# Altium schematic sheet PowerBRDConn.SchDoc
size A4; SheetNumber: 10; SheetTotal: 10
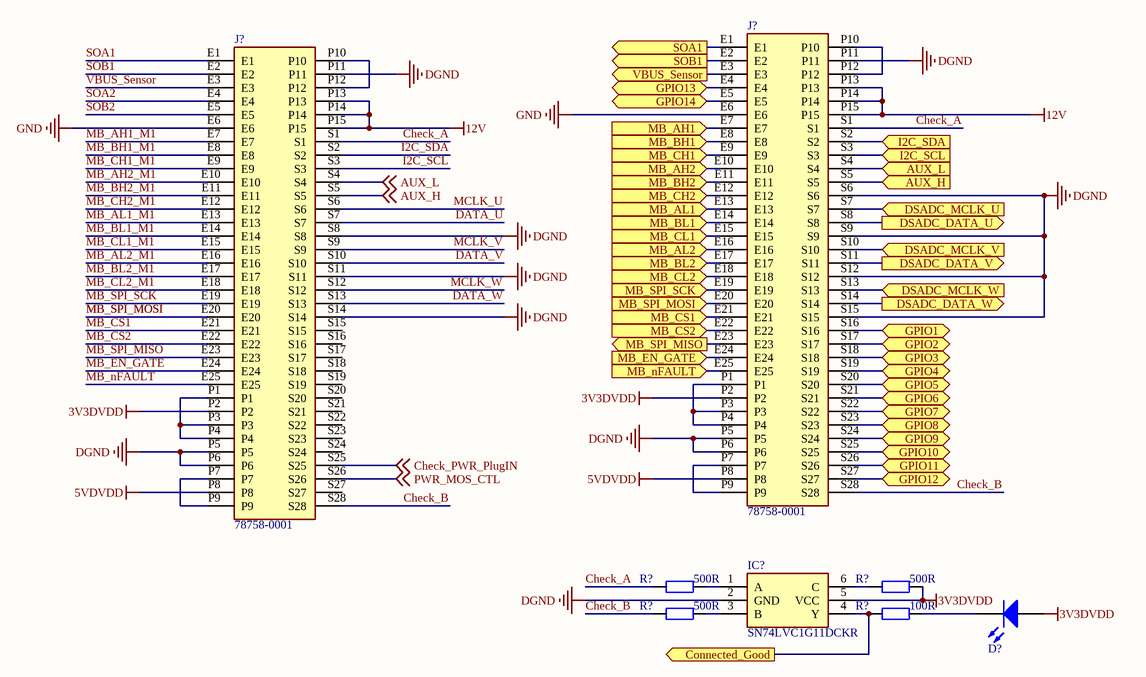
[diagram p0: PowerBRDConn.SchDoc]

## Parts
(Parts that share a designator on the sheet are numbered #1, #2 ... from top to bottom, then left to right.)
D?  LED  [LED_A2]  (value not drawn)
IC?  SN74LVC1G11DCKR  [SOT65P210X110-6N]
J?#1  78758-0001  [78758-0001]
J?#2  78758-0001  [78758-0001]
R?#1  500R  [R 0603_L]
R?#2  500R  [R 0603_L]
R?#3  500R  [R 0603_L]
R?#4  100R  [R 0603_L]

## Ports
AUX_H (in), AUX_L (in), Connected_Good (out), DSADC_DATA_U (out), DSADC_DATA_V (out), DSADC_DATA_W (out), DSADC_MCLK_U (in), DSADC_MCLK_V (in), DSADC_MCLK_W (in), GPIO1 (bidir), GPIO2 (bidir), GPIO3 (bidir), GPIO4 (bidir), GPIO5 (bidir), GPIO6 (bidir), GPIO7 (bidir), GPIO8 (bidir), GPIO9 (bidir), GPIO10 (bidir), GPIO11 (bidir), GPIO12 (bidir), GPIO13 (bidir), GPIO14 (bidir), I2C_SCL (in), I2C_SDA (in), MB_AH1 (in), MB_AH2 (in), MB_AL1 (in), MB_AL2 (in), MB_BH1 (in), MB_BH2 (in), MB_BL1 (in), MB_BL2 (in), MB_CH1 (in), MB_CH2 (in), MB_CL1 (in), MB_CL2 (in), MB_CS1 (in), MB_CS2 (in), MB_EN_GATE (in), MB_nFAULT (in), MB_SPI_MISO (out), MB_SPI_MOSI (in), MB_SPI_SCK (in), SOA1 (out), SOB1 (out), VBUS_Sensor (out)

## Nets
3V3DVDD: D?.1(A) IC?.5(VCC) J?#1.P2 J?#2.P2 R?#2.1
5VDVDD: J?#1.P8 J?#2.P8
12V: J?#1.P13 J?#1.P14 J?#1.P15 J?#2.P13 J?#2.P14 J?#2.P15
DGND: IC?.2(GND) J?#1.P5 J?#1.P6 J?#1.P11 J?#1.S6 J?#1.S9 J?#1.S12 J?#1.S15 J?#2.P5 J?#2.P6 J?#2.P11 J?#2.S8 J?#2.S11 J?#2.S14
GND: J?#1.E6 J?#2.E6
AUX_H: J?#1.S5 ; port AUX_H
AUX_H: J?#2.S5 ; off-sheet AUX_H  [a separate net that carries the same name]
AUX_L: J?#1.S4 ; port AUX_L
AUX_L: J?#2.S4 ; off-sheet AUX_L  [a separate net that carries the same name]
Check_A: J?#1.S1 J?#2.S1 R?#1.2
Check_B: J?#1.S28 J?#2.S28 R?#3.2
Check_PWR_PlugIN: J?#2.S25 ; off-sheet Check_PWR_PlugIN
Connected_Good: IC?.4(Y) R?#4.2 ; port Connected_Good
DATA_U: J?#2.S7
DATA_V: J?#2.S10
DATA_W: J?#2.S13
DSADC_DATA_U: J?#1.S8 ; port DSADC_DATA_U
DSADC_DATA_V: J?#1.S11 ; port DSADC_DATA_V
DSADC_DATA_W: J?#1.S14 ; port DSADC_DATA_W
DSADC_MCLK_U: J?#1.S7 ; port DSADC_MCLK_U
DSADC_MCLK_V: J?#1.S10 ; port DSADC_MCLK_V
DSADC_MCLK_W: J?#1.S13 ; port DSADC_MCLK_W
GPIO1: J?#1.S16 ; port GPIO1
GPIO2: J?#1.S17 ; port GPIO2
GPIO3: J?#1.S18 ; port GPIO3
GPIO4: J?#1.S19 ; port GPIO4
GPIO5: J?#1.S20 ; port GPIO5
GPIO6: J?#1.S21 ; port GPIO6
GPIO7: J?#1.S22 ; port GPIO7
GPIO8: J?#1.S23 ; port GPIO8
GPIO9: J?#1.S24 ; port GPIO9
GPIO10: J?#1.S25 ; port GPIO10
GPIO11: J?#1.S26 ; port GPIO11
GPIO12: J?#1.S27 ; port GPIO12
GPIO13: J?#1.E4 ; port GPIO13
GPIO14: J?#1.E5 ; port GPIO14
I2C_SCL: J?#1.S3 ; port I2C_SCL
I2C_SCL: J?#2.S3  [a separate net that carries the same name]
I2C_SDA: J?#1.S2 ; port I2C_SDA
I2C_SDA: J?#2.S2  [a separate net that carries the same name]
MB_AH1: J?#1.E7 ; port MB_AH1
MB_AH1_M1: J?#2.E7
MB_AH2: J?#1.E10 ; port MB_AH2
MB_AH2_M1: J?#2.E10
MB_AL1: J?#1.E13 ; port MB_AL1
MB_AL1_M1: J?#2.E13
MB_AL2: J?#1.E16 ; port MB_AL2
MB_AL2_M1: J?#2.E16
MB_BH1: J?#1.E8 ; port MB_BH1
MB_BH1_M1: J?#2.E8
MB_BH2: J?#1.E11 ; port MB_BH2
MB_BH2_M1: J?#2.E11
MB_BL1: J?#1.E14 ; port MB_BL1
MB_BL1_M1: J?#2.E14
MB_BL2: J?#1.E17 ; port MB_BL2
MB_BL2_M1: J?#2.E17
MB_CH1: J?#1.E9 ; port MB_CH1
MB_CH1_M1: J?#2.E9
MB_CH2: J?#1.E12 ; port MB_CH2
MB_CH2_M1: J?#2.E12
MB_CL1: J?#1.E15 ; port MB_CL1
MB_CL1_M1: J?#2.E15
MB_CL2: J?#1.E18 ; port MB_CL2
MB_CL2_M1: J?#2.E18
MB_CS1: J?#1.E21 ; port MB_CS1
MB_CS1: J?#2.E21  [a separate net that carries the same name]
MB_CS2: J?#1.E22 ; port MB_CS2
MB_CS2: J?#2.E22  [a separate net that carries the same name]
MB_EN_GATE: J?#1.E24 ; port MB_EN_GATE
MB_EN_GATE: J?#2.E24  [a separate net that carries the same name]
MB_nFAULT: J?#1.E25 ; port MB_nFAULT
MB_nFAULT: J?#2.E25  [a separate net that carries the same name]
MB_SPI_MISO: J?#1.E23 ; port MB_SPI_MISO
MB_SPI_MISO: J?#2.E23  [a separate net that carries the same name]
MB_SPI_MOSI: J?#1.E20 ; port MB_SPI_MOSI
MB_SPI_MOSI: J?#2.E20  [a separate net that carries the same name]
MB_SPI_SCK: J?#1.E19 ; port MB_SPI_SCK
MB_SPI_SCK: J?#2.E19  [a separate net that carries the same name]
MCLK_U: J?#2.S6
MCLK_V: J?#2.S9
MCLK_W: J?#2.S12
PWR_MOS_CTL: J?#2.S26 ; off-sheet PWR_MOS_CTL
SOA1: J?#1.E1 ; port SOA1
SOA1: J?#2.E1  [a separate net that carries the same name]
SOA2: J?#2.E4
SOB1: J?#1.E2 ; port SOB1
SOB1: J?#2.E2  [a separate net that carries the same name]
SOB2: J?#2.E5
VBUS_Sensor: J?#1.E3 ; port VBUS_Sensor
VBUS_Sensor: J?#2.E3  [a separate net that carries the same name]
NetD?_2: D?.2(K) R?#4.1
NetIC?_1: IC?.1(A) R?#1.1
NetIC?_3: IC?.3(B) R?#3.1
NetIC?_6: IC?.6(C) R?#2.2
NetJ?#1_P1: J?#1.P1 J?#1.P3 J?#1.P4
NetJ?#1_P7: J?#1.P7 J?#1.P9
NetJ?#1_P10: J?#1.P10 J?#1.P12
NetJ?#2_P1: J?#2.P1 J?#2.P3 J?#2.P4
NetJ?#2_P7: J?#2.P7 J?#2.P9
NetJ?#2_P10: J?#2.P10 J?#2.P12

Not connected (* = marked no-connect by the designer): J?#2 S15 S16 S17 S18 S19 S20 S21 S22 S23 S24 S27

## Library data of the parts
D? = LED: 发光二极管; 技术支持，联系售后: https://shop463601444.taobao.com
IC? = SN74LVC1G11DCKR: Integrated Circuit; Manufacturer_Name: Texas Instruments; Datasheet Link: http://componentsearchengine.com/Datasheets/1/SN74LVC1G11DCKR.pdf; Height: 1.1mm; Manufacturer_Part_Number: SN74LVC1G11DCKR; Mouser Part Number: 595-SN74LVC1G11DCKR; Mouser Price/Stock: https://www.mouser.co.uk/ProductDetail/Texas-Instruments/SN74LVC1G11DCKR?qs=nqigI8dpoHIKzrNU0QT3Ag%3D%3D; Arrow Part Number: SN74LVC1G11DCKR; Arrow Price/Stock: https://www.arrow.com/en/products/sn74lvc1g11dckr/texas-instruments?region=nac
J?#1 J?#2 = 78758-0001: Connector; Manufacturer_Name: Molex; Manufacturer_Part_Number: 78758-0001; Mouser Part Number: 538-78758-0001; Mouser Price/Stock: https://www.mouser.co.uk/ProductDetail/Molex/78758-0001?qs=wOSGPAwRNAFEK7d2ROR5rw%3D%3D
R?#1-R?#4 = R: 贴片电阻; 版权归属: 来自淘宝 ID：黄晶宝石; 封装库来自淘宝卖家 ID：黄晶宝石: 其他店铺购入均为盗版，不享受售后技术支持服务，请立即申请退款; BOM名称: 贴片电阻; 联系售后: https://shop463601444.taobao.com